# Altium project QFN68_DIP72_SMT.PrjPcb
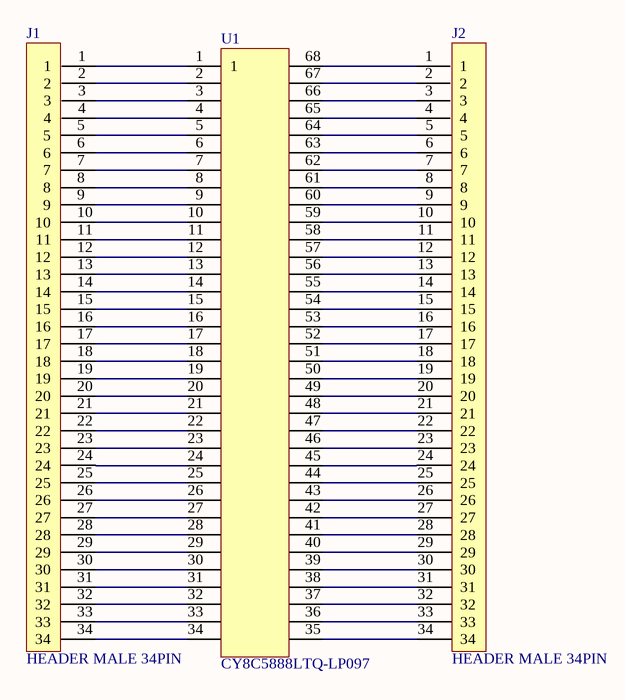
[diagram p0: QFN68_DIP72_SMT_Schematic.SchDoc]
1 sheet, 3 parts. Net scope: global (net labels, ports and power ports of the same name join across sheets).
Board files: QFN68_DIP72_SMT_PCB.PcbDoc, QFN68_DIP72_SMT_PCB_45gradi.PcbDoc

## Sheet QFN68_DIP72_SMT_Schematic.SchDoc
size 199 x 200 mm; SheetNumber: 1; SheetTotal: 1

### Parts
J1  HEADER MALE 34PIN  [HDR_MALE_1x4_2.54mm]
J2  HEADER MALE 34PIN  [HDR_MALE_1x4_2.54mm]
U1  CY8C5888LTQ-LP097  [CYP-LTX68_L]

### Nets
NetJ1_1: J1.1 U1.1
NetJ1_2: J1.2 U1.2
NetJ1_3: J1.3 U1.3
NetJ1_4: J1.4 U1.4
NetJ1_5: J1.5 U1.5
NetJ1_6: J1.6 U1.6
NetJ1_7: J1.7 U1.7
NetJ1_8: J1.8 U1.8
NetJ1_9: J1.9 U1.9
NetJ1_10: J1.10 U1.10
NetJ1_11: J1.11 U1.11
NetJ1_12: J1.12 U1.12
NetJ1_13: J1.13 U1.13
NetJ1_14: J1.14 U1.14
NetJ1_15: J1.15 U1.15
NetJ1_16: J1.16 U1.16
NetJ1_17: J1.17 U1.17
NetJ1_18: J1.18 U1.18
NetJ1_19: J1.19 U1.19
NetJ1_20: J1.20 U1.20
NetJ1_21: J1.21 U1.21
NetJ1_22: J1.22 U1.22
NetJ1_23: J1.23 U1.23
NetJ1_24: J1.24 U1.24
NetJ1_25: J1.25 U1.25
NetJ1_26: J1.26 U1.26
NetJ1_27: J1.27 U1.27
NetJ1_28: J1.28 U1.28
NetJ1_29: J1.29 U1.29
NetJ1_30: J1.30 U1.30
NetJ1_31: J1.31 U1.31
NetJ1_32: J1.32 U1.32
NetJ1_33: J1.33 U1.33
NetJ1_34: J1.34 U1.34
NetJ2_1: J2.1 U1.68
NetJ2_2: J2.2 U1.67
NetJ2_3: J2.3 U1.66
NetJ2_4: J2.4 U1.65
NetJ2_5: J2.5 U1.64
NetJ2_6: J2.6 U1.63
NetJ2_7: J2.7 U1.62
NetJ2_8: J2.8 U1.61
NetJ2_9: J2.9 U1.60
NetJ2_10: J2.10 U1.59
NetJ2_11: J2.11 U1.58
NetJ2_12: J2.12 U1.57
NetJ2_13: J2.13 U1.56
NetJ2_14: J2.14 U1.55
NetJ2_15: J2.15 U1.54
NetJ2_16: J2.16 U1.53
NetJ2_17: J2.17 U1.52
NetJ2_18: J2.18 U1.51
NetJ2_19: J2.19 U1.50
NetJ2_20: J2.20 U1.49
NetJ2_21: J2.21 U1.48
NetJ2_22: J2.22 U1.47
NetJ2_23: J2.23 U1.46
NetJ2_24: J2.24 U1.45
NetJ2_25: J2.25 U1.44
NetJ2_26: J2.26 U1.43
NetJ2_27: J2.27 U1.42
NetJ2_28: J2.28 U1.41
NetJ2_29: J2.29 U1.40
NetJ2_30: J2.30 U1.39
NetJ2_31: J2.31 U1.38
NetJ2_32: J2.32 U1.37
NetJ2_33: J2.33 U1.36
NetJ2_34: J2.34 U1.35

### Library data of the parts
J1 J2 = 77311-101-34LF: Headers & Wire Housings 34P STR SR TMT HDR .76 AU .425IN LENGTH; Manufacturer: Amphenol ICC / FCI; Number of Contacts: 34; Max Voltage Rating (AC): 1.5kV; Connector Type: Male Pin; Current Rating: 3A; Insulation Resistance: 5GR; Pitch: 2.54mm; Contact Post Length: 2.41mm; Supplier 1: Newark; Manufacturer Part Number: 77311-101-34LF; RoHS: Yes; Category: Connectors; Pricing 1: 400=1,25000, 500=1,16000, 1000=1,02000 (USD); Mount: Through Hole; Contact Plating: Gold,GXT; Contact Material: Bronze; Color: Black; Housing Color: Black; Housing Material: Thermoplastic; Material: Thermoplastic; Min Operating Temperature: -65°C; Max Operating Temperature: 125°C; Number of Rows: 1; Termination: Solder; Packaging: Bulk; Package Quantity: 100; Number of Positions: 34; Orientation: Straight; Series: BERGSTIK®, MezzSelect™, Basics+; Contact Type: Male Pin; Voltage Rating: 1.5kV; Gender: Male; Contact Gender: Male; Length: 86.36mm; Depth: 2.4mm; Contact Mating Length: 0.23inch; Lead Free: Lead Free; REACH SVHC: No SVHC; Flammability Rating: UL94 V-0; ComponentLink1URL: https://datasheet.ciiva.com/8050/320503-8050396.pdf?src-supplier=Element14; ComponentLink1Description: https://datasheet.ciiva.com/8050/320503-8050396.pdf?src-supplier=Element14; ComponentLink2URL: https://datasheet.ciiva.com/10116/77311-10116809.pdf?src-supplier=Avnet; ComponentLink2Description: https://datasheet.ciiva.com/10116/77311-10116809.pdf?src-supplier=Avnet; ComponentLink3URL: https://datasheet.ciiva.com/16729/77311-16729755.pdf?src-supplier=Avnet+Europe; ComponentLink3Description: https://datasheet.ciiva.com/16729/77311-16729755.pdf?src-supplier=Avnet+Europe; ComponentLink4URL: https://datasheet.ciiva.com/722/77311-722458.pdf?src-supplier=Digi-Key; ComponentLink4Description: https://datasheet.ciiva.com/722/77311-722458.pdf?src-supplier=Digi-Key; Supplier Part Number 1: 62K8798
U1 = CY8C5888LTQ-LP097: MCU 32-bit ARM Cortex M3 RISC 256KB Flash 1.8V/3.3V/5V 68-Pin QFN EP Tray; Manufacturer: Cypress; Interface: I2C,SPI,USB,UART,USART; Peripherals: POR,PWM,WDT,DMA,LCD,CapSense; Frequency: 80MHz; Number of I/Os: 38; Oscillator Type: Internal; Supplier 1: Digi-Key; Manufacturer Part Number: CY8C5888LTQ-LP097; RoHS: Yes; Category: Microcontrollers; Stock 1: 85; Pricing 1: 1=25,00000, 10=23,12600, 25=21,25080, 80=19,75075, 260=18,12573, 520=17,25069 (USD); Case/Package: QFN; Min Operating Temperature: -40°C; Max Operating Temperature: 105°C; Memory Type: FLASH; Packaging: Tray; Core Architecture: ARM; Memory Size: 256KB; RoHS Compliant: Yes; ComponentLink1URL: http://www.farnell.com/datasheets/2343841.pdf?src-supplier=Farnell; ComponentLink1Description: http://www.farnell.com/datasheets/2343841.pdf?src-supplier=Farnell; ComponentLink2URL: http://www.mouser.com/ds/2/100/001-84932_PSoC_5LP_CY8C58LP_Family_Datasheet_Progr-1078031.pdf?src-supplier=Mouser; ComponentLink2Description: http://www.mouser.com/ds/2/100/001-84932_PSoC_5LP_CY8C58LP_Family_Datasheet_Progr-1078031.pdf?src-supplier=Mouser; ComponentLink3URL: http://www.cypress.com/?docID=49437&src-supplier=Digi-Key; ComponentLink3Description: http://www.cypress.com/?docID=49437&src-supplier=Digi-Key; Supplier Part Number 1: CY8C5888LTQ-LP097-ND